# EAGLE design controller2 (EAGLE 9.6.2)
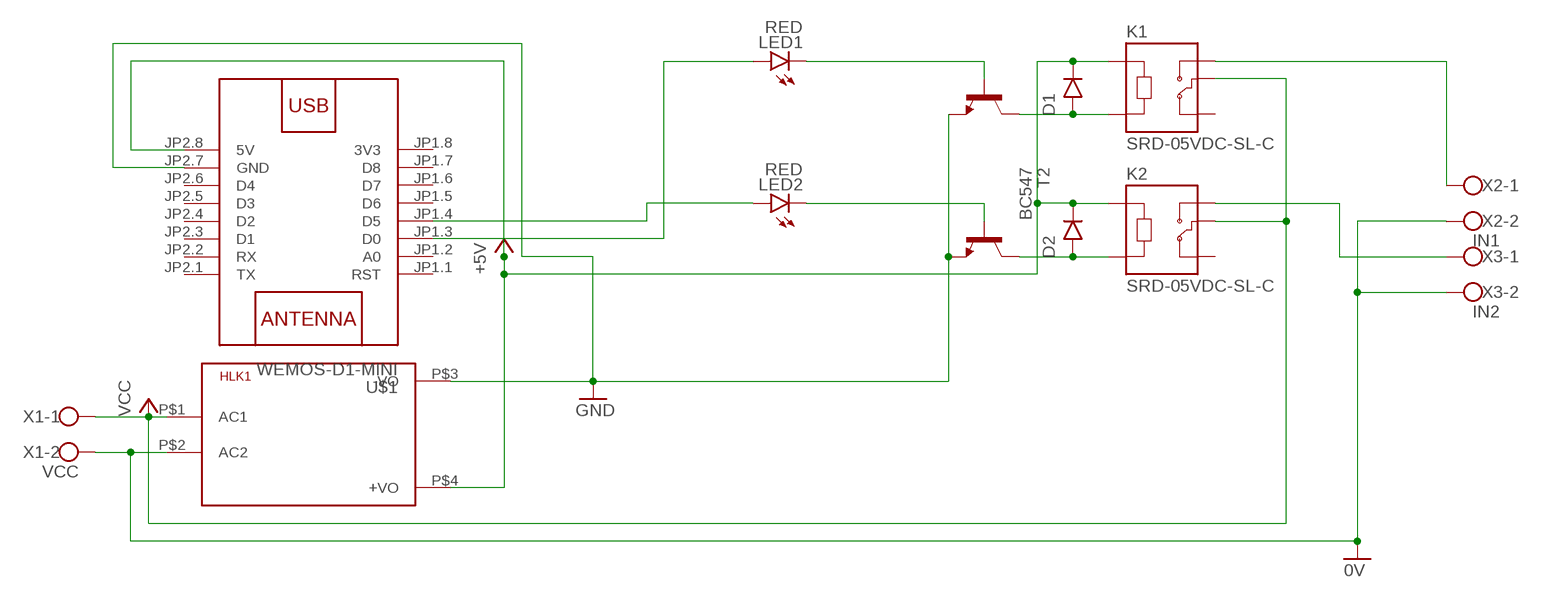
[diagram p0: schematic, sheet 1]

## Parts
D1  1N4001  [DO41-10]
D2  1N4001  [DO41-10]
HLK1  HLK-PM013W  [HLK-PM01]
K1  SRD-05VDC-SL-C  [RELAY_SRD-05VDC-SL-C]
K2  SRD-05VDC-SL-C  [RELAY_SRD-05VDC-SL-C]
LED1  RED  LED3MM  [LED3MM]
LED2  RED  LED3MM  [LED3MM]
T1  BC547  [TO92]
T2  BC547  [TO92]
U$1  WEMOS-D1-MINI  [WEMOS-D1-MINI]
X1  VCC  W237-102  [W237-102]
X2  IN1  W237-102  [W237-102]
X3  IN2  W237-102  [W237-102]

## Nets
0V: HLK1.P$2(AC2) X1.2 X2.2 X3.2
+5V: D1.C(CATHODE) D2.C(CATHODE) HLK1.P$4(+VO) K1.A1 K2.A1 U$1.JP2.8(5V)
GND: HLK1.P$3(-VO) T1.1(E) T2.1(E) U$1.JP2.7(GND)
N$1: D1.A(ANODE) K1.A2 T1.3(C)
N$2: K1.NO X2.1
N$3: D2.A(ANODE) K2.A2 T2.3(C)
N$8: LED2.K(C) T2.2(B)
N$9: LED1.K(C) T1.2(B)
N$11: K2.NO X3.1
N$14: LED2.A U$1.JP1.4(D5)
N$15: LED1.A U$1.JP1.3(D0)
VCC: HLK1.P$1(AC1) K1.COM K2.COM X1.1
Unconnected: K1.NC K2.NC U$1.JP1.1(RST) U$1.JP1.2(A0) U$1.JP1.5(D6) U$1.JP1.6(D7) U$1.JP1.7(D8) U$1.JP2.1(TX) U$1.JP2.2(RX) U$1.JP2.3(D1) U$1.JP2.4(D2) U$1.JP2.5(D3) U$1.JP2.6(D4)

## Power pins joined to a net without a drawn wire
3V3: U$1.JP1.8(3V3)

## Library data of the parts
D1 D2 = tango:1N4001: DIODE general purpose rectifier, 1 A
HLK1 = HLK-PM01:HLK-PM01: Hi-Link Power Supply HLK-PM01 3W Author: Ahmed Said <https://github.com/AhmedSaid/EAGLELibraries>
K1 K2 = SRD-05VDC-SL-C (1):SRD-05VDC-SL-C: 5V Trigger Relay Module For Arduino And Raspberry Pi 5V Trigger Relay Module For Arduino And Raspberry Pi; AVAILABILITY: Unavailable; DESCRIPTION: 5V Trigger Relay Module For Arduino And Raspberry Pi 5V Trigger Relay Module For Arduino And Raspberry Pi; MF: Songle Relay; MP: SRD-05VDC-SL-C; PACKAGE: None; PRICE: None
LED1 LED2 = led:LED: LED OSRAM: - CHIPLED LG R971, LG N971, LY N971, LG Q971, LY Q971, LO R971, LY R971 LH N974, LH R974 LS Q976, LO Q976, LY Q976 LO Q996 - Hyper CHIPLED LW Q18S LB Q993, LB Q99A, LB R99A - SideLED LS A670, LO A670, LY A670, LG A670, LP A670 LB A673, LV A673, LT A673, LW A673 LH A674 LY A675 LS A676, LA A676, LO A676, LY A676, LW A676 LS A679, LY A679, LG A679 - Hyper Micro SIDELED® LS Y876, LA Y876, LO Y876, LY Y876 LT Y87S - SmartLED LW L88C, LW L88S LB L89C, LB L89S, LG L890 LS L89K, LO L89K, LY L89K LS L896, LA L896, LO L896, LY L896 - TOPLED LS T670, LO T670, LY T670, LG T670, LP T670 LSG T670, LSP T670, LSY T670, LOP T670, LYG T670 LG T671, LOG T671, LSG T671 LB T673, LV T673, LT T673, LW T673 LH T674 LS T676, LA T676, LO T676, LY T676, LB T676, LH T676, LSB T676, LW T676 LB T67C, LV T67C, LT T67C, LS T67K, LO T67K, LY T67K, LW E67C LS E67B, LA E67B, LO E67B, LY E67B, LB E67C, LV E67C, LT E67C LW T67C LS T679, LY T679, LG T679 LS T770, LO T770, LY T770, LG T770, LP T770 LB T773, LV T773, LT T773, LW T773 LH T774 LS E675, LA E675, LY E675, LS T675 LS T776, LA T776, LO T776, LY T776, LB T776 LHGB T686 LT T68C, LB T68C - Hyper Mini TOPLED® LB M676 - Mini TOPLED Santana® LG M470 LS M47K, LO M47K, LY M47K Source: http://www.osram.convergy.de LUXEON: - LUMILED® LXK2-PW12-R00, LXK2-PW12-S00, LXK2-PW14-U00, LXK2-PW14-V00 LXK2-PM12-R00, LXK2-PM12-S00, LXK2-PM14-U00 LXK2-PE12-Q00, LXK2-PE12-R00, LXK2-PE12-S00, LXK2-PE14-T00, LXK2-PE14-U00 LXK2-PB12-K00, LXK2-PB12-L00, LXK2-PB12-M00, LXK2-PB14-N00, LXK2-PB14-P00, LXK2-PB14-Q00 LXK2-PR12-L00, LXK2-PR12-M00, LXK2-PR14-Q00, LXK2-PR14-R00 LXK2-PD12-Q00, LXK2-PD12-R00, LXK2-PD12-S00 LXK2-PH12-R00, LXK2-PH12-S00 LXK2-PL12-P00, LXK2-PL12-Q00, LXK2-PL12-R00 Source: www.luxeon.com KINGBRIGHT: KA-3528ASYC Source: www.kingbright.com
T1 T2 = transistor:BC547: NPN TRANSISTOR
U$1 = diy-modules:WEMOS-D1-MINI: WEMOS D1 mini: Mini Wi-Fi Board based on ESP-8266 device More details can be found here: https://www.wemos.cc/product/d1-mini.html Click here to find device on ebay.com <http://www.ebay.com/sch/wemos+d1+mini+nodemcu>
X1-X3 = con-wago-500:W237-102: WAGO SCREW CLAMP; MPN: 237-102; OC_FARNELL: unknown; OC_NEWARK: 70K9898

## Board
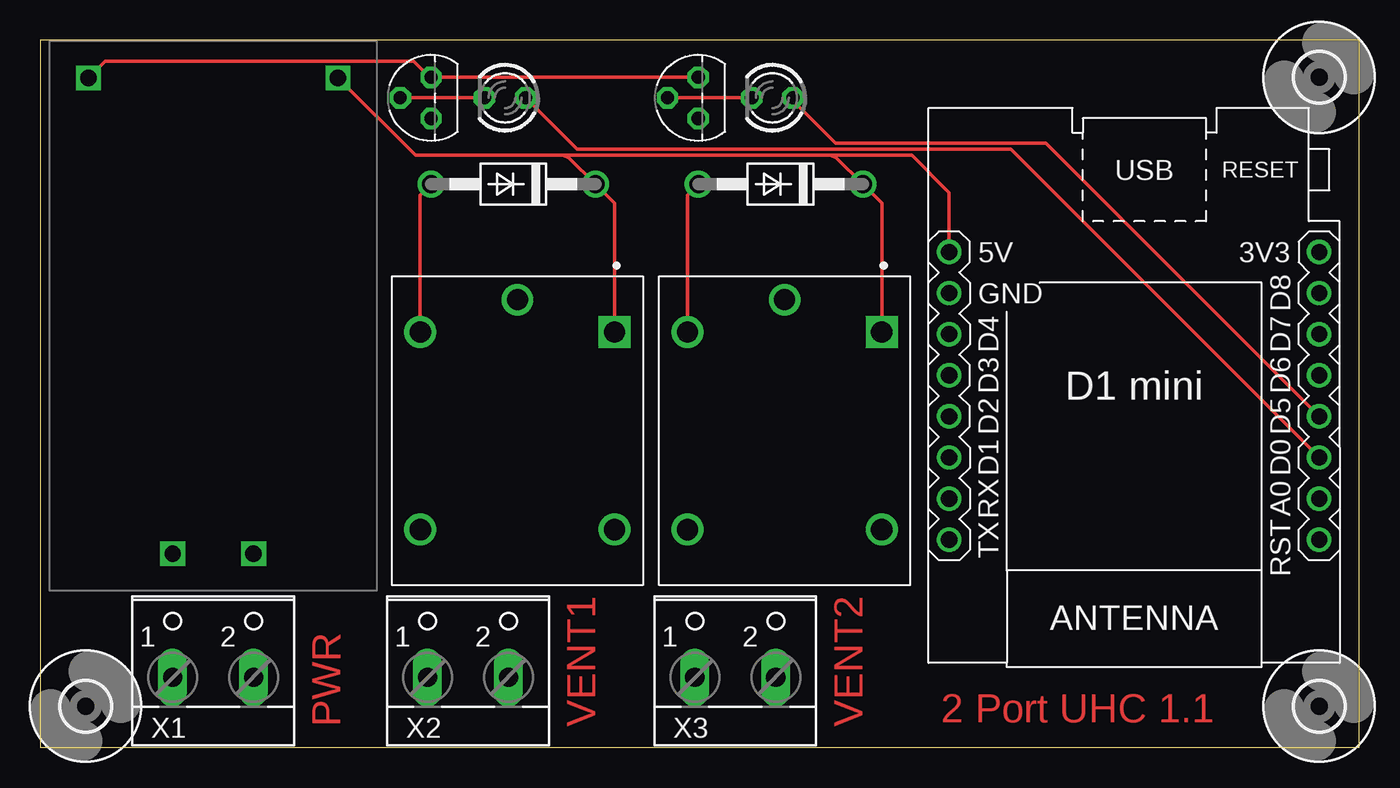
[diagram p1: board, top side]
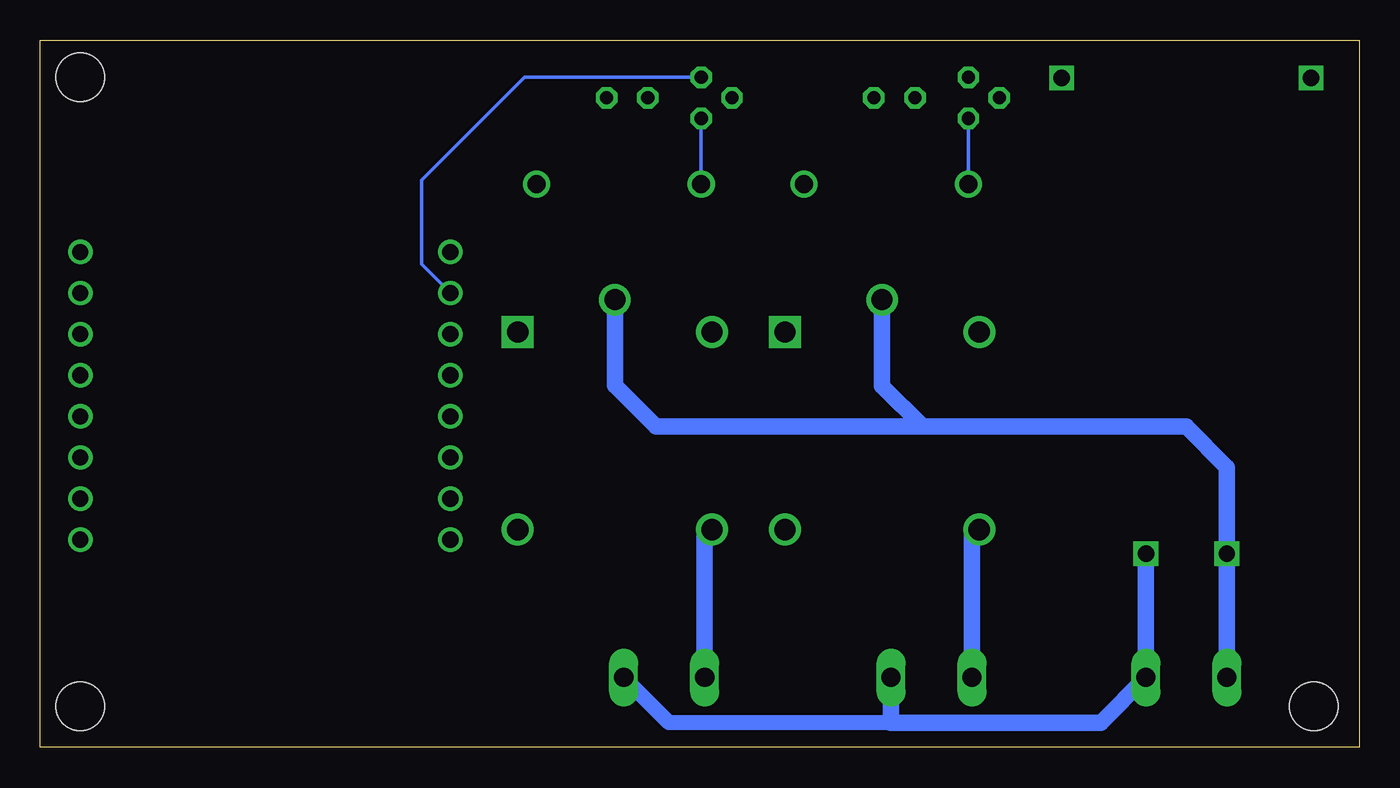
[diagram p2: board, bottom side, seen from below]

Size 81.46 x 43.68 mm. Coordinates in mm from the lower left corner, seen from the top.
Outline: 0,0 81.46,0 81.46,43.68 0,43.68 0,0
Copper layers (1*16): Top 0.035mm / dielectric 1.5mm / Bottom 0.035mm
Design rules "default": minimum track width 6mil, minimum drill 0.35mm, track to track 6mil, track to pad 6mil, pad to pad 6mil, via to via 6mil, smd to smd 6mil, copper to edge 40mil, drill to drill 6mil, minimum pad ring 10mil, minimum via ring 8mil, stop-mask expansion 4mil, vias tented up to drill 0mil, thermal gap 10mil

### Footprints (pad centres in the part's own frame; a part is rotated, then mirrored left to right if it is on the bottom)
DO41-10 = drill 1.118: A 5.08,0; C -5.08,0
HLK-PM01 = drill 1.016 square: P$1 -14.7,2.5; P$2 -14.7,-2.5; P$3 14.7,7.7; P$4 14.7,-7.7
RELAY_SRD-05VDC-SL-C = drill 1.32 square: A1 -6.1,6 | drill 1.32: A2 -6.1,-6; NC 6.1,6; NO 6.1,-6 | drill 1.29: COM -8.1,0
LED3MM = drill 0.813 octagon: A -1.27,0; K 1.27,0
TO92 = drill 0.813 octagon: 1 1.27,0; 2 0,1.905; 3 -1.27,0
WEMOS-D1-MINI = drill 1: JP1.1 -11.43,9.525; JP1.2 -11.43,6.985; JP1.3 -11.43,4.445; JP1.4 -11.43,1.905; JP1.5 -11.43,-0.635; JP1.6 -11.43,-3.175; JP1.7 -11.43,-5.715; JP1.8 -11.43,-8.255; JP2.1 11.43,9.525; JP2.2 11.43,6.985; JP2.3 11.43,4.445; JP2.4 11.43,1.905; JP2.5 11.43,-0.635; JP2.6 11.43,-3.175; JP2.7 11.43,-5.715; JP2.8 11.43,-8.255
3,0 = hole 3: 0,0
W237-102 = drill 1.194 long: 1 -2.5,-1.27; 2 2.5,-1.27

### Placement (x,y rotation side)
D1  29.21,34.8 180 top
D2  45.72,34.8 180 top
HLK1  10.67,26.67 90 top
K1  29.46,19.56 270 top
K2  45.97,19.56 270 top
LED1  28.7,40.13 180 top
LED2  45.21,40.13 180 top
T1  24.13,40.13 90 top
T2  40.64,40.13 90 top
U$1  67.56,22.35 180 top
U$2  [3,0]  78.99,2.54 0 top
U$3  [3,0]  2.79,2.54 0 top
U$4  [3,0]  78.99,41.4 0 top
X1  10.67,5.59 0 top
X2  26.42,5.59 0 top
X3  42.93,5.59 0 top

### Tracks (layer width: path | path; a pad name or v marks a point on that pad's centre or on a via)
0V
  Bottom 0.914: 28.96,1.52 42.63,1.52 X3.2
  Bottom 1.016: HLK1.P$2 X1.2 15.96,1.52 28.96,1.52 28.92,1.56 X2.2
+5V
  Top 0.229: HLK1.P$4 23.16,36.58 32.29,36.58 | 32.29,36.58 32.64,36.45 D1.C 35.46,33.62 K1.A1 | 32.29,36.58 48.8,36.58 | 48.8,36.58 53.85,36.58 56.13,34.29 U$1.JP2.8 | 48.8,36.58 49.15,36.45 D2.C 51.97,33.62 K2.A1
GND
  Top 0.229: HLK1.P$3 4,42.4 23.05,42.4 24.05,41.4 T1.1 T2.1
  Bottom 0.229: U$1.JP2.7 57.91,29.84 57.91,35.05 51.56,41.4 T2.1
N$1
  Top 0.229: 23.37,25.75 K1.A2 23.46,34.13 D1.A
  Bottom 0.229: T1.3 D1.A
N$2
  Bottom 1.016: K1.NO 23.92,13.01 X2.1
N$3
  Top 0.229: K2.A2 39.97,34.13 D2.A
  Bottom 0.229: T2.3 D2.A
N$8
  Top 0.229: LED2.K T2.2
N$9
  Top 0.229: T1.2 LED1.K
N$11
  Bottom 1.016: K2.NO 40.43,13.01 X3.1
N$14
  Top 0.229: U$1.JP1.4 62.1,37.34 49.11,37.34 46.31,40.13 LED2.A
N$15
  Top 0.229: LED1.A 33.15,36.96 59.94,36.96 U$1.JP1.3
VCC
  Bottom 1.016: X1.1 HLK1.P$1 8.17,17.3 10.68,19.81 26.95,19.81 | K2.COM 45.97,22.35 43.43,19.81 26.95,19.81 | K1.COM 29.46,22.32 26.95,19.81

### Text on the board
Top: 2 Port UHC 1.1 | PWR | VENT1 | VENT2